# Altium schematic sheet CPU_POWER.SchDoc
size A3; SheetNumber: 4; SheetTotal: 9
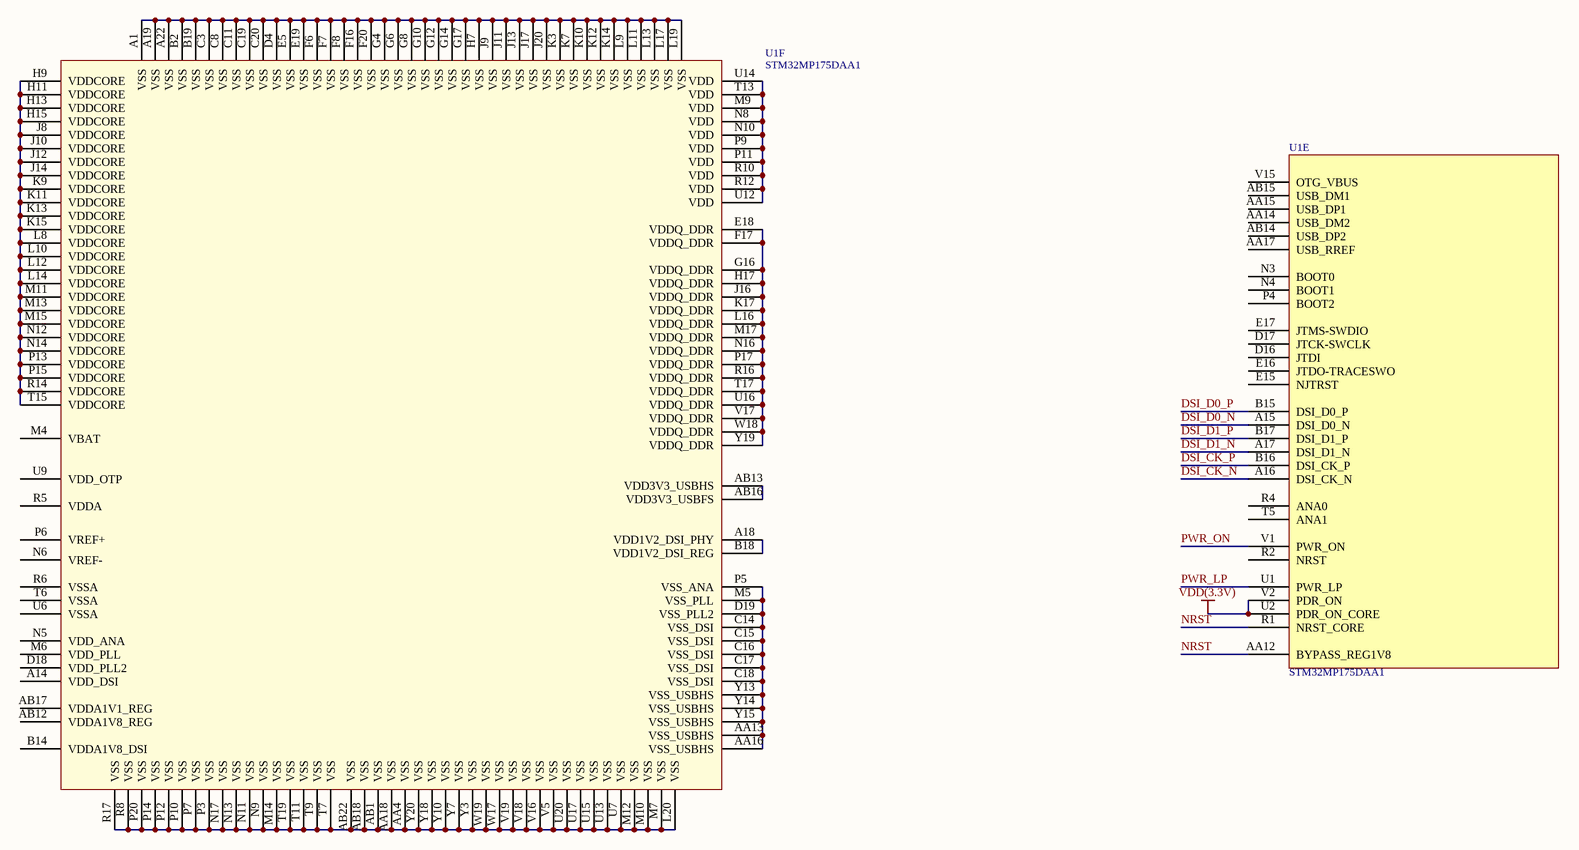
[diagram p0: CPU_POWER.SchDoc]

## Parts
U1  STM32MP175DAA1  [LFBGA448]  (parts E,F of 7)

## Nets
VDD(3.3V): U1.U2(PDR_ON_CORE) U1.V2(PDR_ON)
DSI_CK_N: U1.A16(DSI_CK_N)
DSI_CK_P: U1.B16(DSI_CK_P)
DSI_D0_N: U1.A15(DSI_D0_N)
DSI_D0_P: U1.B15(DSI_D0_P)
DSI_D1_N: U1.A17(DSI_D1_N)
DSI_D1_P: U1.B17(DSI_D1_P)
NRST: U1.AA12(BYPASS_REG1V8) U1.R1(NRST_CORE)
PWR_LP: U1.U1(PWR_LP)
PWR_ON: U1.V1(PWR_ON)
NetU1_A1: U1.A1(VSS) U1.A19(VSS) U1.A22(VSS) U1.B2(VSS) U1.B19(VSS) U1.C3(VSS) U1.C8(VSS) U1.C11(VSS) U1.C19(VSS) U1.C20(VSS) U1.D4(VSS) U1.E5(VSS) U1.E19(VSS) U1.F6(VSS) U1.F7(VSS) U1.F8(VSS) U1.F16(VSS) U1.F20(VSS) U1.G4(VSS) U1.G6(VSS) U1.G8(VSS) U1.G10(VSS) U1.G12(VSS) U1.G14(VSS) U1.G17(VSS) U1.H7(VSS) U1.J9(VSS) U1.J11(VSS) U1.J13(VSS) U1.J17(VSS) U1.J20(VSS) U1.K3(VSS) U1.K7(VSS) U1.K10(VSS) U1.K12(VSS) U1.K14(VSS) U1.L9(VSS) U1.L11(VSS) U1.L13(VSS) U1.L17(VSS) U1.L19(VSS)
NetU1_A18: U1.A18(VDD1V2_DSI_PHY) U1.B18(VDD1V2_DSI_REG)
NetU1_AA4: U1.AA4(VSS) U1.AA18(VSS) U1.AB1(VSS) U1.AB18(VSS) U1.AB22(VSS) U1.L20(VSS) U1.M7(VSS) U1.M10(VSS) U1.M12(VSS) U1.M14(VSS) U1.N9(VSS) U1.N11(VSS) U1.N13(VSS) U1.N17(VSS) U1.P3(VSS) U1.P7(VSS) U1.P10(VSS) U1.P12(VSS) U1.P14(VSS) U1.P20(VSS) U1.R8(VSS) U1.R17(VSS) U1.T7(VSS) U1.T9(VSS) U1.T11(VSS) U1.T19(VSS) U1.U7(VSS) U1.U13(VSS) U1.U15(VSS) U1.U17(VSS) U1.U20(VSS) U1.V5(VSS) U1.V16(VSS) U1.V18(VSS) U1.V19(VSS) U1.W17(VSS) U1.W19(VSS) U1.Y3(VSS) U1.Y7(VSS) U1.Y10(VSS) U1.Y18(VSS) U1.Y20(VSS)
NetU1_AA13: U1.AA13(VSS_USBHS) U1.AA16(VSS_USBHS) U1.C14(VSS_DSI) U1.C15(VSS_DSI) U1.C16(VSS_DSI) U1.C17(VSS_DSI) U1.C18(VSS_DSI) U1.D19(VSS_PLL2) U1.M5(VSS_PLL) U1.P5(VSS_ANA) U1.Y13(VSS_USBHS) U1.Y14(VSS_USBHS) U1.Y15(VSS_USBHS)
NetU1_AB13: U1.AB13(VDD3V3_USBHS) U1.AB16(VDD3V3_USBFS)
NetU1_E18: U1.E18(VDDQ_DDR) U1.F17(VDDQ_DDR) U1.G16(VDDQ_DDR) U1.H17(VDDQ_DDR) U1.J16(VDDQ_DDR) U1.K17(VDDQ_DDR) U1.L16(VDDQ_DDR) U1.M17(VDDQ_DDR) U1.N16(VDDQ_DDR) U1.P17(VDDQ_DDR) U1.R16(VDDQ_DDR) U1.T17(VDDQ_DDR) U1.U16(VDDQ_DDR) U1.V17(VDDQ_DDR) U1.W18(VDDQ_DDR) U1.Y19(VDDQ_DDR)
NetU1_H9: U1.H9(VDDCORE) U1.H11(VDDCORE) U1.H13(VDDCORE) U1.H15(VDDCORE) U1.J8(VDDCORE) U1.J10(VDDCORE) U1.J12(VDDCORE) U1.J14(VDDCORE) U1.K9(VDDCORE) U1.K11(VDDCORE) U1.K13(VDDCORE) U1.K15(VDDCORE) U1.L8(VDDCORE) U1.L10(VDDCORE) U1.L12(VDDCORE) U1.L14(VDDCORE) U1.M11(VDDCORE) U1.M13(VDDCORE) U1.M15(VDDCORE) U1.N12(VDDCORE) U1.N14(VDDCORE) U1.P13(VDDCORE) U1.P15(VDDCORE) U1.R14(VDDCORE) U1.T15(VDDCORE)
NetU1_M9: U1.M9(VDD) U1.N8(VDD) U1.N10(VDD) U1.P9(VDD) U1.P11(VDD) U1.R10(VDD) U1.R12(VDD) U1.T13(VDD) U1.U12(VDD) U1.U14(VDD)

Not connected (* = marked no-connect by the designer): U1 A14(VDD_DSI) AA14(USB_DM2) AA15(USB_DP1) AA17(USB_RREF) AB12(VDDA1V8_REG) AB14(USB_DP2) AB15(USB_DM1) AB17(VDDA1V1_REG) B14(VDDA1V8_DSI) D16(JTDI) D17(JTCK-SWCLK) D18(VDD_PLL2) E15(NJTRST) E16(JTDO-TRACESWO) E17(JTMS-SWDIO) M4(VBAT) M6(VDD_PLL) N3(BOOT0) N4(BOOT1) N5(VDD_ANA) N6(VREF-) P4(BOOT2) P6(VREF+) R2(NRST) R4(ANA0) R5(VDDA) R6(VSSA) T5(ANA1) T6(VSSA) U6(VSSA) U9(VDD_OTP) V15(OTG_VBUS)

## Library data of the parts
U1 = STM32MP175AAA3